# EAGLE design aiotdaan_r2 (EAGLE 7.7.0)
CNAME: AIoT DaaN; CREVISION: R1; DESIGNER: lamloei.com/aiot_daan
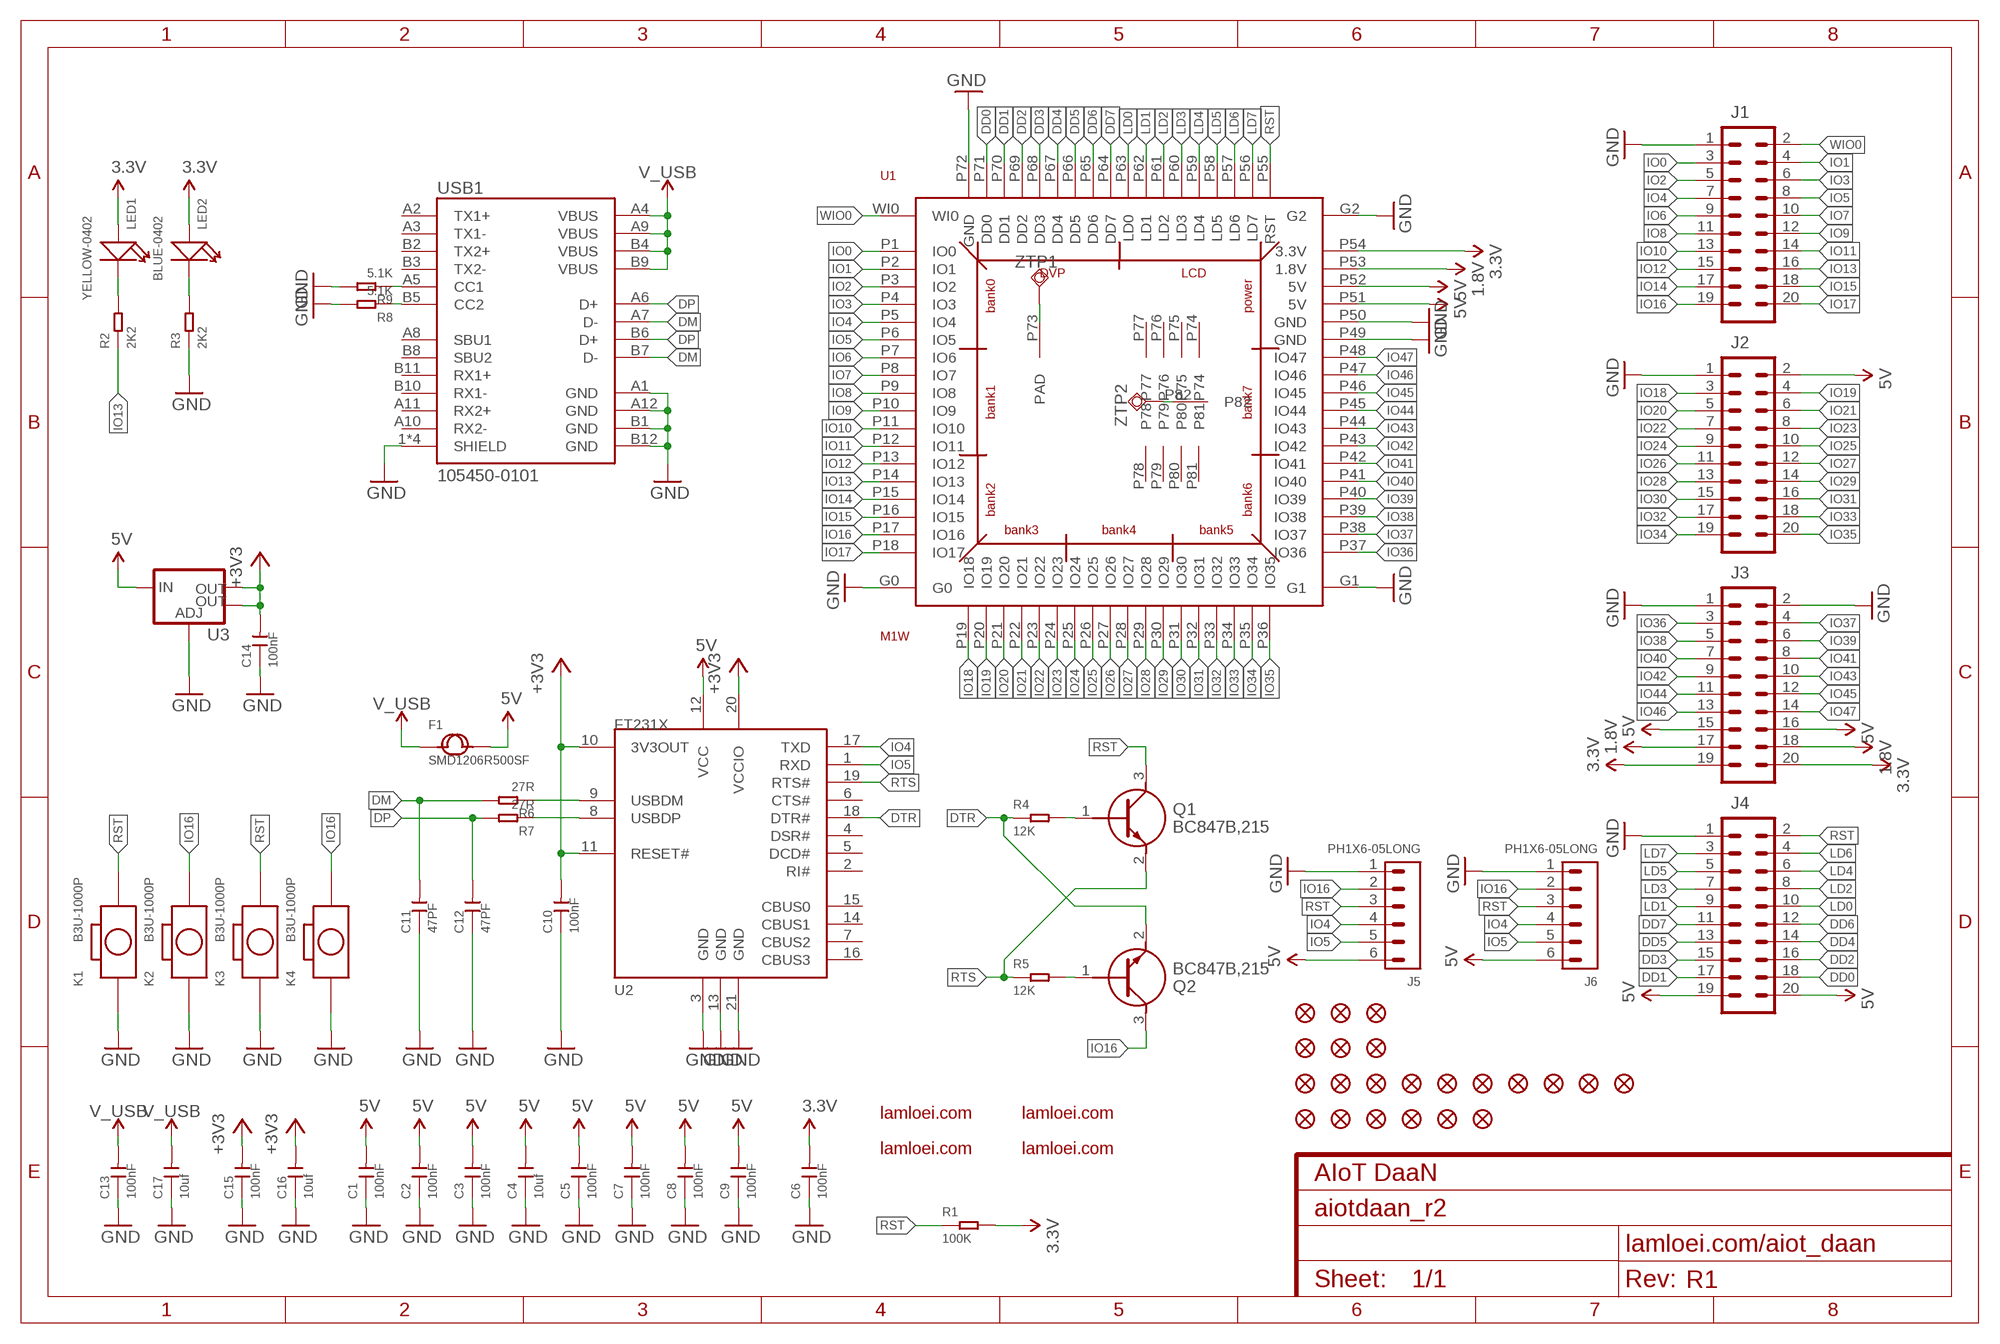
[diagram p0: schematic, sheet 1]

## Parts
C1  100nF  CERAMIC-47PF-50V-5%-NP0(0402)  [C0402]
C2  100nF  CERAMIC-47PF-50V-5%-NP0(0402)  [C0402]
C3  100nF  CERAMIC-47PF-50V-5%-NP0(0402)  [C0402]
C4  10uf  CERAMIC-22UF-6.3V-20%-X5R(0805)  [C0805]
C5  100nF  CERAMIC-47PF-50V-5%-NP0(0402)  [C0402]
C6  100nF  CERAMIC-47PF-50V-5%-NP0(0402)  [C0402]
C7  100nF  CERAMIC-47PF-50V-5%-NP0(0402)  [C0402]
C8  100nF  CERAMIC-47PF-50V-5%-NP0(0402)  [C0402]
C9  100nF  CERAMIC-47PF-50V-5%-NP0(0402)  [C0402]
C10  100nF  CERAMIC-47PF-50V-5%-NP0(0402)  [C0402]
C11  47PF  CERAMIC-47PF-50V-5%-NP0(0402)  [C0402]
C12  47PF  CERAMIC-47PF-50V-5%-NP0(0402)  [C0402]
C13  100nF  CERAMIC-47PF-50V-5%-NP0(0402)  [C0402]
C14  100nF  CERAMIC-47PF-50V-5%-NP0(0402)  [C0402]
C15  100nF  CERAMIC-47PF-50V-5%-NP0(0402)  [C0402]
C16  10uf  CERAMIC-22UF-6.3V-20%-X5R(0805)  [C0805]
C17  10uf  CERAMIC-22UF-6.3V-20%-X5R(0805)  [C0805]
F1  SMD1206R500SF  SMD-PPTC-500MA(1206)  [F1206]
J1  M10X2  [2X10]
J2  M10X2  [2X10]
J3  M10X2  [2X10]
J4  M10X2  [2X10]
J5  PH1X6-05LONG  [PHL005-1-6]
J6  PH1X6-05LONG  [PHL005-1-6]
K1  B3U-1000P  SMD-BUTTON-WITHOUT-BOSS-(2P-3X2.5MM)  [SW2-SMD-3.0X2.5X1.2+0.4MM]
K2  B3U-1000P  SMD-BUTTON-WITHOUT-BOSS-(2P-3X2.5MM)  [SW2-SMD-3.0X2.5X1.2+0.4MM]
K3  B3U-1000P  SMD-BUTTON-WITHOUT-BOSS-(2P-3X2.5MM)  [SW2-SMD-3.0X2.5X1.2+0.4MM]
K4  B3U-1000P  SMD-BUTTON-WITHOUT-BOSS-(2P-3X2.5MM)  [SW2-SMD-3.0X2.5X1.2+0.4MM]
LED1  YELLOW-0402  SMD-LED-CLEAR-BLUE(0402)  [LED-0402]
LED2  BLUE-0402  SMD-LED-CLEAR-BLUE(0402)  [LED-0402]
Q1  BC847B,215  [SOT95P230X110-3N]
Q2  BC847B,215  [SOT95P230X110-3N]
R1  100K  SMD-RES-22R-1%-1/16W(0402)  [R0402]
R2  2K2  SMD-RES-22R-1%-1/16W(0402)  [R0402]
R3  2K2  SMD-RES-22R-1%-1/16W(0402)  [R0402]
R4  12K  SMD-RES-22R-1%-1/16W(0402)  [R0402]
R5  12K  SMD-RES-22R-1%-1/16W(0402)  [R0402]
R6  27R  SMD-RES-22R-1%-1/16W(0402)  [R0402]
R7  27R  SMD-RES-22R-1%-1/16W(0402)  [R0402]
R8  5.1K  SMD-RES-22R-1%-1/16W(0402)  [R0402]
R9  5.1K  SMD-RES-22R-1%-1/16W(0402)  [R0402]
U1  M1W  [M1W]
U2  FT231X-Q  [QFN20]
U3  V_REG_LM1117SOT223  [SOT223]
USB1  105450-0101  [MOLEX_105450-0101]
ZFCB1  FIDUCIAL1X2  [FIDUCIAL-1X2]
ZFCB2  FIDUCIAL1X2  [FIDUCIAL-1X2]
ZFCB3  FIDUCIAL1X2  [FIDUCIAL-1X2]
ZFCT1  FIDUCIAL1X2  [FIDUCIAL-1X2]
ZFCT2  FIDUCIAL1X2  [FIDUCIAL-1X2]
ZFCT3  FIDUCIAL1X2  [FIDUCIAL-1X2]
ZFDB1  FIDUCIAL1X2  [FIDUCIAL-1X2]
ZFDB2  FIDUCIAL1X2  [FIDUCIAL-1X2]
ZFDB3  FIDUCIAL1X2  [FIDUCIAL-1X2]
ZFDB4  FIDUCIAL1X2  [FIDUCIAL-1X2]
ZFDB5  FIDUCIAL1X2  [FIDUCIAL-1X2]
ZFDB6  FIDUCIAL1X2  [FIDUCIAL-1X2]
ZFDT1  FIDUCIAL1X2  [FIDUCIAL-1X2]
ZFDT2  FIDUCIAL1X2  [FIDUCIAL-1X2]
ZFDT3  FIDUCIAL1X2  [FIDUCIAL-1X2]
ZFDT4  FIDUCIAL1X2  [FIDUCIAL-1X2]
ZFDT5  FIDUCIAL1X2  [FIDUCIAL-1X2]
ZFDT6  FIDUCIAL1X2  [FIDUCIAL-1X2]
ZFDT7  FIDUCIAL1X2  [FIDUCIAL-1X2]
ZFDT8  FIDUCIAL1X2  [FIDUCIAL-1X2]
ZFDT9  FIDUCIAL1X2  [FIDUCIAL-1X2]
ZFDT10  FIDUCIAL1X2  [FIDUCIAL-1X2]
ZL1  LAMLOEI_BIGLOGO  [LAMLOEI_BIGLOGO]
ZL2  LAMLOEI_BIGLOGO  [LAMLOEI_BIGLOGO]
ZL3  LAMLEOI_LOGO_3  [LAMLEOI_LOGO_3]
ZL4  LAMLEOI_LOGO_3  [LAMLEOI_LOGO_3]
ZTP1  TPSQTP20SQ  [TP20SQ]
ZTP2  TPSQTP20SQ  [TP20SQ]

## Nets
1.8V: J3.17 J3.18 U1.P53(1.8V)
3.3V: C6.2 J3.19 J3.20 LED1.+ LED2.+ R1.2 U1.P54(3.3V)
5V: C1.2 C2.2 C3.2 C4.2 C5.2 C7.2 C8.2 C9.2 F1.2 J2.2 J3.15 J3.16 J4.19 J4.20 J5.6 J6.6 U1.P51(5V) U1.P52(5V) U2.12(VCC) U3.3(IN)
+3V3: C10.2 C14.2 C15.2 C16.2 U2.10(3V3OUT) U2.11(RESET#) U2.20(VCCIO) U3.2(OUT) U3.4(OUT)
DD0: J4.18 U1.P71(DD0)
DD1: J4.17 U1.P70(DD1)
DD2: J4.16 U1.P69(DD2)
DD3: J4.15 U1.P68(DD3)
DD4: J4.14 U1.P67(DD4)
DD5: J4.13 U1.P66(DD5)
DD6: J4.12 U1.P65(DD6)
DD7: J4.11 U1.P64(DD7)
DM: C11.2 R6.2 USB1.A7(D-) USB1.B7(D-)
DP: C12.2 R7.2 USB1.A6(D+) USB1.B6(D+)
DTR: Q2.2(E) R4.1 U2.18(DTR#)
GND: C1.1 C2.1 C3.1 C4.1 C5.1 C6.1 C7.1 C8.1 C9.1 C10.1 C11.1 C12.1 C13.1 C14.1 C15.1 C16.1 C17.1 J1.1 J2.1 J3.1 J3.2 J4.1 J5.1 J6.1 K1.1 K2.1 K3.1 K4.1 R3.1 R8.2 R9.2 U1.G0 U1.G1 U1.G2 U1.P49(GND) U1.P50(GND) U1.P72(GND) U2.3(GND) U2.13(GND) U2.21(GND) U3.1(ADJ) USB1.1(SHIELD) USB1.2(SHIELD) USB1.3(SHIELD) USB1.4(SHIELD) USB1.A1(GND) USB1.A12(GND) USB1.B1(GND) USB1.B12(GND)
IO0: J1.3 U1.P1(IO0)
IO1: J1.4 U1.P2(IO1)
IO2: J1.5 U1.P3(IO2)
IO3: J1.6 U1.P4(IO3)
IO4: J1.7 J5.4 J6.4 U1.P5(IO4) U2.17(TXD)
IO5: J1.8 J5.5 J6.5 U1.P6(IO5) U2.1(RXD)
IO6: J1.9 U1.P7(IO6)
IO7: J1.10 U1.P8(IO7)
IO8: J1.11 U1.P9(IO8)
IO9: J1.12 U1.P10(IO9)
IO10: J1.13 U1.P11(IO10)
IO11: J1.14 U1.P12(IO11)
IO12: J1.15 U1.P13(IO12)
IO13: J1.16 R2.1 U1.P14(IO13)
IO14: J1.17 U1.P15(IO14)
IO15: J1.18 U1.P16(IO15)
IO16: J1.19 J5.2 J6.2 K2.2 K4.2 Q2.3(C) U1.P17(IO16)
IO17: J1.20 U1.P18(IO17)
IO18: J2.3 U1.P19(IO18)
IO19: J2.4 U1.P20(IO19)
IO20: J2.5 U1.P21(IO20)
IO21: J2.6 U1.P22(IO21)
IO22: J2.7 U1.P23(IO22)
IO23: J2.8 U1.P24(IO23)
IO24: J2.9 U1.P25(IO24)
IO25: J2.10 U1.P26(IO25)
IO26: J2.11 U1.P27(IO26)
IO27: J2.12 U1.P28(IO27)
IO28: J2.13 U1.P29(IO28)
IO29: J2.14 U1.P30(IO29)
IO30: J2.15 U1.P31(IO30)
IO31: J2.16 U1.P32(IO31)
IO32: J2.17 U1.P33(IO32)
IO33: J2.18 U1.P34(IO33)
IO34: J2.19 U1.P35(IO34)
IO35: J2.20 U1.P36(IO35)
IO36: J3.3 U1.P37(IO36)
IO37: J3.4 U1.P38(IO37)
IO38: J3.5 U1.P39(IO38)
IO39: J3.6 U1.P40(IO39)
IO40: J3.7 U1.P41(IO40)
IO41: J3.8 U1.P42(IO41)
IO42: J3.9 U1.P43(IO42)
IO43: J3.10 U1.P44(IO43)
IO44: J3.11 U1.P45(IO44)
IO45: J3.12 U1.P46(IO45)
IO46: J3.13 U1.P47(IO46)
IO47: J3.14 U1.P48(IO47)
LD0: J4.10 U1.P63(LD0)
LD1: J4.9 U1.P62(LD1)
LD2: J4.8 U1.P61(LD2)
LD3: J4.7 U1.P60(LD3)
LD4: J4.6 U1.P59(LD4)
LD5: J4.5 U1.P58(LD5)
LD6: J4.4 U1.P57(LD6)
LD7: J4.3 U1.P56(LD7)
N$1: U1.P73(PAD) ZTP1.TP
N$2: U1.P82 ZTP2.TP
N$3: LED1.- R2.2
N$4: R8.1 USB1.B5(CC2)
N$5: R9.1 USB1.A5(CC1)
N$6: LED2.- R3.2
N$7: R7.1 U2.8(USBDP)
N$8: R6.1 U2.9(USBDM)
N$11: Q2.1(B) R5.2
N$12: Q1.1(B) R4.2
RST: J4.2 J5.3 J6.3 K1.2 K3.2 Q1.3(C) R1.1 U1.P55(RST)
RTS: Q1.2(E) R5.1 U2.19(RTS#)
V_USB: C13.2 C17.2 F1.1 USB1.A4(VBUS) USB1.A9(VBUS) USB1.B4(VBUS) USB1.B9(VBUS)
WIO0: J1.2 U1.WI0
Unconnected: U1.P74 U1.P75 U1.P76 U1.P77 U1.P78 U1.P79 U1.P80 U1.P81 U2.2(RI#) U2.4(DSR#) U2.5(DCD#) U2.6(CTS#) U2.7(CBUS2) U2.14(CBUS1) U2.15(CBUS0) U2.16(CBUS3) USB1.A2(TX1+) USB1.A3(TX1-) USB1.A8(SBU1) USB1.A10(RX2-) USB1.A11(RX2+) USB1.B2(TX2+) USB1.B3(TX2-) USB1.B8(SBU2) USB1.B10(RX1-) USB1.B11(RX1+)

## Library data of the parts
C1-C3 C5-C10 C13-C15 = Capacitor-2016:CERAMIC-47PF-50V-5%-NP0(0402): 302010007; MPN: CC0402JRNPO9BN470; VALUE: 47PF
C4 C16 C17 = Capacitor-2016:CERAMIC-22UF-6.3V-20%-X5R(0805): 302010171; MPN: CC0805MKX5R5BB226; VALUE: 22uf
C11 C12 = Capacitor-2016:CERAMIC-47PF-50V-5%-NP0(0402): 302010007; MPN: CC0402JRNPO9BN470
F1 = Seeed-Fuse-2016:SMD-PPTC-500MA(1206): 307010002; MPN: SMD1206R500SF
J1-J4 = SparkFun-Connectors:M10X2: This was SPECIALLY designed to be used with our Graphic LCD Backpack. Be sure you want to use this! It is not only staggered on each line of header holes, but IT IS ALSO offset of the center point of the top and bottom lines by 5 mil. This causes the headers to lock into place on the "standard" footprint on the LCD screen. The extra squares on the tdocu layer are there simply to reference other pins (if you were to actually populate a longer header than ten long - this is what we do with the backpacks).
J5 J6 = pel_hdr:PH1X6
K1-K4 = Seeed-OPL-Button4:SMD-BUTTON-WITHOUT-BOSS-(2P-3X2.5MM): 311020047
LED1 = Seeed-OPL-Diode:SMD-LED-CLEAR-BLUE(0402): 304090075; MPN: BL-HB337A-AV-TRB; VALUE: BLUE-0402
LED2 = Seeed-OPL-Diode:SMD-LED-CLEAR-BLUE(0402): 304090075; MPN: BL-HB337A-AV-TRB
Q1 Q2 = BC847B_215:BC847B,215: BC847 series - 45 V, 100 mA NPN general-purpose transistors Source: Datasheet <http://uk.rs-online.com/web/p/products/4367947P>; DESCRIPTION: BC847 series - 45 V, 100 mA NPN general-purpose transistors; HEIGHT: 1.1mm; MANUFACTURER_NAME: Nexperia; MANUFACTURER_PART_NUMBER: BC847B,215; RS_PART_NUMBER: 4367947P
R1-R9 = Resistor-2016:SMD-RES-22R-1%-1/16W(0402): 301010052; MPN: RC0402FR-0722RL; VALUE: 22R
U1 = lamloei_m2_m1w:M1W
U2 = FT231X-3:FT231X
U3 = SparkFun-PowerIC-2:V_REG_LM1117: Voltage Regulator LM1117 Standard adjustable voltage regulator but in SMD form. Spark Fun Electronics SKU : COM-00595; PROD_ID: VREG-08170
USB1 = 105450-0101:105450-0101: USB Shielded I/O Receptacle; Type C; Right Angle; Surface Mount; Gold over Nickel; AVAILABILITY: Good; DESCRIPTION: USB Shielded I/O Receptacle; Type C; Right Angle; Surface Mount; Gold over Nickel; MF: Molex; MP: 105450-0101; PACKAGE: None; PRICE: 1.73 USD
ZFCB1-ZFCB3 ZFCT1-ZFCT3 ZFDB1-ZFDB6 ZFDT1-ZFDT10 = SparkFun-Aesthetics:FIDUCIAL: Fiducial Alignment Points Various fiducial points for machine vision alignment.
ZL1 ZL2 = lamloei_logo_3:LAMLOEI_BIGLOGO
ZL3 ZL4 = lamloei_logo_3:LAMLEOI_LOGO_3: lamloei
ZTP1 ZTP2 = testpad:TPSQ: Test pad

## Board
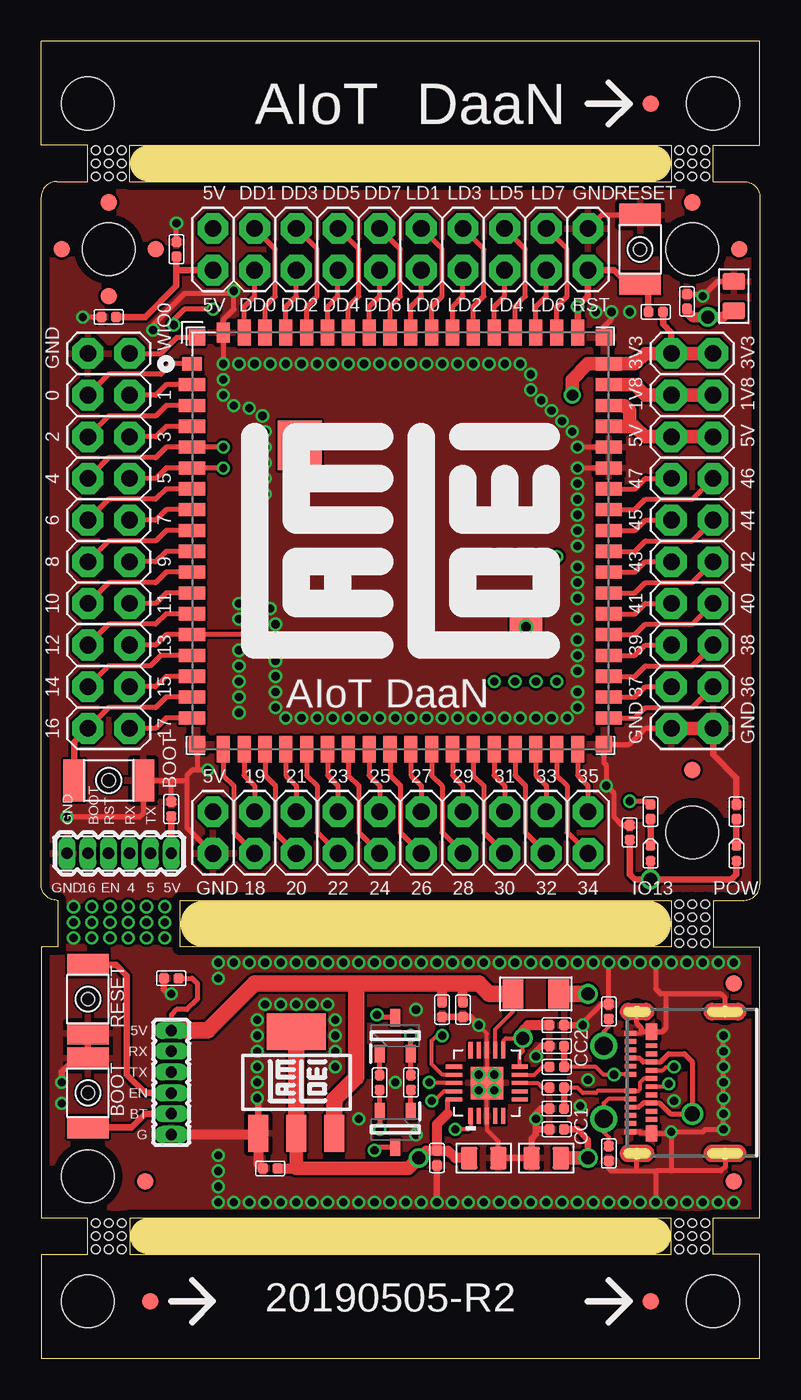
[diagram p1: board, top side]
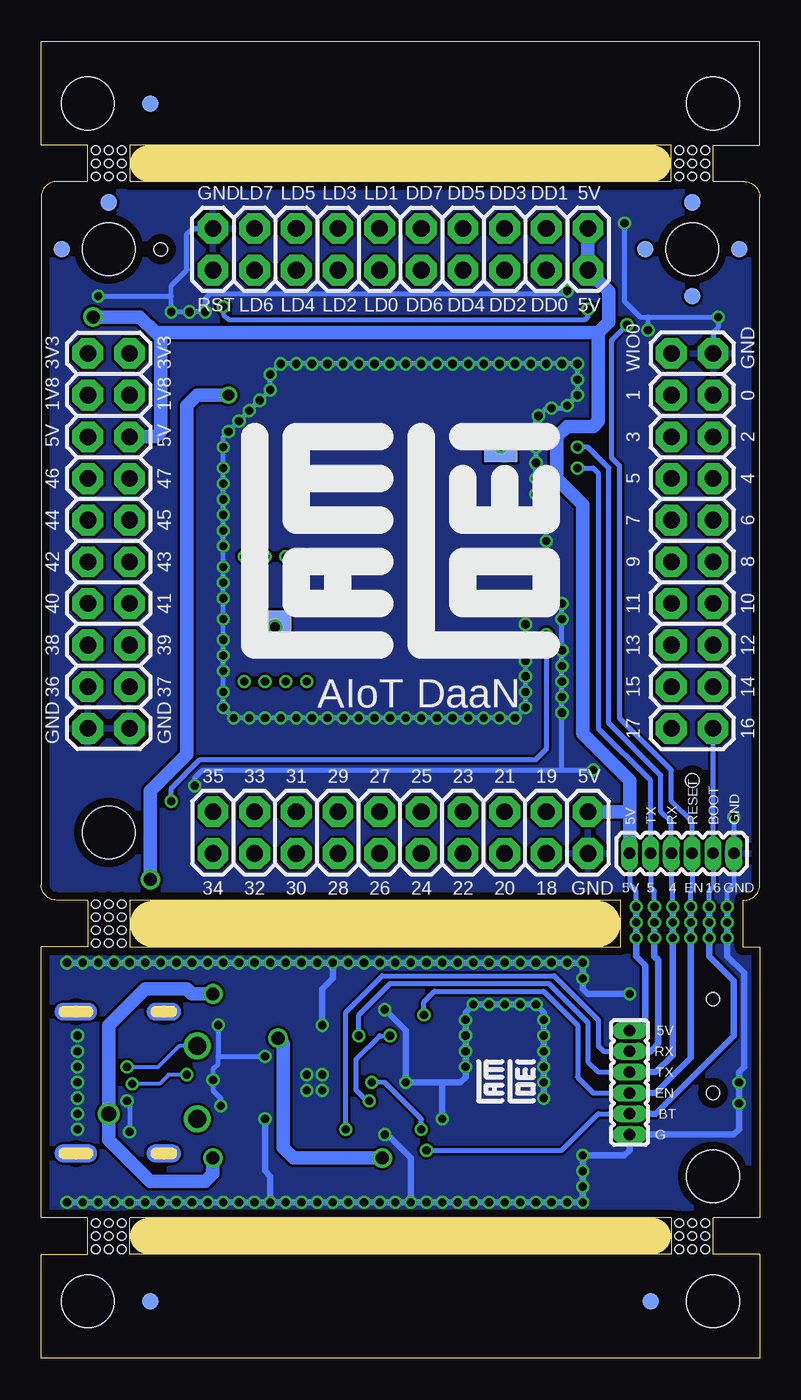
[diagram p2: board, bottom side, seen from below]

Size 43.81 x 80.33 mm. Coordinates in mm from the lower left corner, seen from the top.
Outline: 0.95,71.75 2.86,71.75 2.86,73.98 0,73.98 0,80.33 43.81,80.33 43.81,73.98 40.96,73.98 40.96,71.75 42.86,71.75 arc-90 43.81,70.8 43.81,28.89 arc-90 42.86,27.94 40.96,27.94 40.96,25.08 43.81,25.08 43.81,8.57 40.96,8.57 40.96,6.35 43.81,6.35 43.81,0 0,0 0,6.35 2.86,6.35 2.86,8.57 0,8.57 0,25.08 1.03,25.08 1.03,27.94 0.95,27.94 arc-90 0,28.89 0,70.8 arc-90 0.95,71.75
Outline: 5.4,71.75 38.42,71.75 38.42,73.98 5.4,73.98 5.4,71.75
Outline: 8.49,27.94 38.42,27.94 38.42,25.08 8.49,25.08 8.49,27.94
Outline: 5.4,8.57 38.42,8.57 38.42,6.35 5.4,6.35 5.4,8.57
Copper layers (1*16): Top 0.035mm / dielectric 1.6mm / Bottom 0.035mm
Design rules "Elecrow_2-layer_PCB_eagle_rule-40": minimum track width 6mil, minimum drill 12mil, track to track 6mil, track to pad 6mil, pad to pad 6mil, via to via 8mil, smd to smd 0mil, copper to edge 20mil, drill to drill 10mil, minimum pad ring 6mil, minimum via ring 6mil, stop-mask expansion 0mil, vias tented up to drill 40mil, thermal gap 10mil
Holes 3.2 mm at 4.13,67.63 39.69,67.63 39.69,32.07 2.86,76.52 40.96,76.52 2.86,3.49 40.96,3.49 2.86,11.11
Holes 0.5 mm at 4.13,72.07 39.69,72.07 40.48,72.07 38.89,72.07 39.69,72.87 40.48,72.87 40.48,73.66 39.69,73.66 38.89,72.87 38.89,73.66 3.33,72.07 4.13,72.87 4.92,72.87 4.92,72.07 4.92,73.66 4.13,73.66 3.33,73.66 3.33,72.87 39.69,27.7 40.48,27.7 38.89,27.7 38.89,26.91 39.69,26.91 40.48,26.91 39.69,26.11 38.89,26.11 40.48,26.11 4.13,8.26 4.92,8.26 4.92,7.46 4.13,7.46 3.33,7.46 3.33,8.26 3.33,6.67 4.13,6.67 4.92,6.67 39.69,8.26 40.48,8.26 38.89,8.26 38.89,7.46 39.69,7.46 40.48,7.46 39.69,6.67 38.89,6.67 40.48,6.67 38.89,25.32 39.69,25.32 40.48,25.32
Holes 0.8 mm at 36.51,67.63 4.13,35.24 2.86,21.91 2.86,16.19
Milling: 3 lines

### Footprints (pad centres in the part's own frame; a part is rotated, then mirrored left to right if it is on the bottom)
C0402 = smd 0.635 x 0.635: 1 0,0.445; 2 0,-0.445
C0805 = smd 1.397 x 1.016: 1 0,0.889; 2 0,-0.889
F1206 = smd 1.27 x 1.778: 1 -1.397,0; 2 1.397,0
2X10 = drill 1.016 pad 1.88 octagon: 1 -11.43,-1.27; 2 -11.43,1.27; 3 -8.89,-1.27; 4 -8.89,1.27; 5 -6.35,-1.27; 6 -6.35,1.27; 7 -3.81,-1.27; 8 -3.81,1.27; 9 -1.27,-1.27; 10 -1.27,1.27; 11 1.27,-1.27; 12 1.27,1.27; 13 3.81,-1.27; 14 3.81,1.27; 15 6.35,-1.27; 16 6.35,1.27; 17 8.89,-1.27; 18 8.89,1.27; 19 11.43,-1.27; 20 11.43,1.27
PHL005-1-6 = drill 0.7 pad 1.016 long: 1 0,0; 2 1.27,0; 3 2.54,0; 4 3.81,0; 5 5.08,0; 6 6.35,0
SW2-SMD-3.0X2.5X1.2+0.4MM = smd 1.346 x 2.54: 1 -2.095,0; 2 2.095,0
LED-0402 = smd 0.58 x 0.58: + -0.468,0; - 0.468,0
SOT95P230X110-3N = smd 1.05 x 0.6: 1 -1.1,0.95; 2 -1.1,-0.95; 3 1.1,0
R0402 = smd 0.635 x 0.635: 1 0,0.445; 2 0,-0.445
M1W = smd 1 x 1: G0 25.1,25.1; G1 0.3,25.1; G2 0.3,0.3; WI0 25.1,0.3 | smd 1.2 x 0.8: P1 25.4,1.905 | smd 1.6 x 0.8: P2 25.4,3.175; P3 25.4,4.445; P4 25.4,5.715; P5 25.4,6.985; P6 25.4,8.255; P7 25.4,9.525; P8 25.4,10.795; P9 25.4,12.065; P10 25.4,13.335; P11 25.4,14.605; P12 25.4,15.875; P13 25.4,17.145; P14 25.4,18.415; P15 25.4,19.685; P16 25.4,20.955; P17 25.4,22.225; P18 25.4,23.495; P37 0,23.495; P38 0,22.225; P39 0,20.955; P40 0,19.685; P41 0,18.415; P42 0,17.145; P43 0,15.875; P44 0,14.605; P45 0,13.335; P46 0,12.065; P47 0,10.795; P48 0,9.525; P49 0,8.255; P50 0,6.985; P51 0,5.715; P52 0,4.445; P53 0,3.175; P54 0,1.905 | smd 0.8 x 1.6: P19 23.495,25.4; P20 22.225,25.4; P21 20.955,25.4; P22 19.685,25.4; P23 18.415,25.4; P24 17.145,25.4; P25 15.875,25.4; P26 14.605,25.4; P27 13.335,25.4; P28 12.065,25.4; P29 10.795,25.4; P30 9.525,25.4; P31 8.255,25.4; P32 6.985,25.4; P33 5.715,25.4; P34 4.445,25.4; P35 3.175,25.4; P36 1.905,25.4; P55 1.905,0; P56 3.175,0; P57 4.445,0; P58 5.715,0; P59 6.985,0; P60 8.255,0; P61 9.525,0; P62 10.795,0; P63 12.065,0; P64 13.335,0; P65 14.605,0; P66 15.875,0; P67 17.145,0; P68 18.415,0; P69 19.685,0; P70 20.955,0; P71 22.225,0 | smd 0.8 x 1.2: P72 23.495,0 | smd 2.67 x 3.02: P73 18.835,6.87 | drill 0.5: P74 3.175,13.652; P75 4.445,13.652; P76 5.715,13.652; P77 6.985,13.652; P78 6.985,21.273; P79 5.715,21.273; P80 4.445,21.273; P81 3.175,21.273 | smd 1.98 x 1.98: P82 5.05,17.96
QFN20 = smd 1 x 0.25: 1 -2.032,0.968; 2 -2.032,0.468; 3 -2.032,-0.032; 4 -2.032,-0.532; 5 -2.032,-1.032; 11 1.968,-1.032; 12 1.968,-0.532; 13 1.968,-0.032; 14 1.968,0.468; 15 1.968,0.968 | smd 0.25 x 1: 6 -1.032,-2.032; 7 -0.532,-2.032; 8 -0.032,-2.032; 9 0.468,-2.032; 10 0.968,-2.032; 16 0.968,1.968; 17 0.468,1.968; 18 -0.032,1.968; 19 -0.532,1.968; 20 -1.032,1.968 | smd 2 x 2: 21 -0.032,-0.032
SOT223 = smd 1.219 x 2.235: 1 -2.311,-3.099; 2 0,-3.099; 3 2.311,-3.099 | smd 3.6 x 2.2: 4 0,3.099
MOLEX_105450-0101 = smd 0.1 x 0.2: 1 -4.7,3.4; 2 3.9,3.4; 3 -4.7,-2; 4 4.7,-2 | smd 0.3 x 0.7: A1 -3,3.77; A2 -2.5,3.77; A3 -2,3.77; A4 -1.5,3.77; A5 -1,3.77; A6 -0.5,3.77; A7 0.5,3.77; A8 1,3.77; A9 1.5,3.77; A10 2,3.77; A11 2.5,3.77; A12 3,3.77; B2 2.25,2.47; B3 1.75,2.47; B4 1.25,2.47; B5 0.75,2.47; B6 0.25,2.47; B7 -0.25,2.47; B8 -0.75,2.47; B9 -1.25,2.47; B10 -1.75,2.47; B11 -2.25,2.47 | smd 1 x 0.7: B1 3.1,2.47; B12 -3.1,2.47 | hole 0.6: -4.32,3.36; 4.32,3.36; -4.32,-2; 4.32,-2
FIDUCIAL-1X2 = smd 1 x 1: 1 0,0
TP20SQ = smd 2 x 2: TP 0,0

### Placement (x,y rotation side)
C1  8.26,67.63 0 top
C2  4.13,63.5 90 top
C3  39.37,64.45 0 top
C4  42.23,64.77 0 top
C5  7.94,33.5 0 top
C6  35.88,32.07 0 top
C7  7.94,23.18 90 top
C8  24.45,21.27 180 top
C9  25.72,21.27 180 top
C10  31.43,20.32 270 top
C11  31.43,19.05 90 top
C12  31.43,15.24 90 top
C13  31.43,13.97 90 top
C14  13.97,11.59 90 top
C15  24.13,12.22 180 top
C16  26.99,12.22 270 top
C17  30.8,12.22 90 top
F1  30.16,22.23 180 top
J1  4.13,49.85 270 top
J2  21.91,32.07 0 top
J3  39.69,49.85 90 top
J4  21.91,67.63 180 top
J5  1.59,30.8 0 top
J6  7.94,13.65 90 top
K1  36.51,67.63 270 top
K2  4.13,35.24 180 top
K3  2.86,21.91 90 top
K4  2.86,16.19 270 top
LED1  37.15,30.8 90 top
LED2  42.39,30.8 90 top
Q1  21.59,19.69 90 top
Q2  21.59,13.97 270 top
R1  37.47,63.82 90 top
R2  37.15,33.34 0 top
R3  42.39,33.34 0 top
R4  20.64,16.83 180 top
R5  22.54,16.83 0 top
R6  31.43,17.78 90 top
R7  31.43,16.51 90 top
R8  34.61,21.15 180 top
R9  34.61,12.5 0 top
U1  34.61,62.55 180 top
U2  27.15,16.83 90 top
U3  15.56,16.83 0 top
USB1  39.69,16.83 90 top
ZFCB1  37.15,76.52 0 bottom
ZFCB2  6.67,3.49 0 bottom
ZFCB3  37.15,3.49 0 bottom
ZFCT1  37.15,76.52 0 top
ZFCT2  6.67,3.49 0 top
ZFCT3  37.15,3.49 0 top
ZFDB1  4.13,70.48 0 bottom
ZFDB2  39.69,70.48 0 bottom
ZFDB3  1.27,67.63 0 bottom
ZFDB4  6.99,67.63 0 bottom
ZFDB5  42.55,67.63 0 bottom
ZFDB6  4.13,64.77 0 bottom
ZFDT1  4.13,70.48 0 top
ZFDT2  39.69,70.48 0 top
ZFDT3  1.27,67.63 0 top
ZFDT4  6.99,67.63 0 top
ZFDT5  42.55,67.63 0 top
ZFDT6  4.13,64.77 0 top
ZFDT7  39.69,35.88 0 top
ZFDT8  42.23,22.86 0 top
ZFDT9  6.35,10.8 0 top
ZFDT10  42.23,10.8 0 top
ZL1  13.02,43.5 0 top
ZL2  30.8,43.5 0 bottom
ZL3  13.65,15.4 0 top
ZL4  17.46,15.4 0 bottom
ZTP1  15.8,55.64 0 bottom
ZTP2  29.56,44.59 0 bottom

### Tracks (layer width: path | path; a pad name or v marks a point on that pad's centre or on a via)
1.8V
  Top 0.813: U1.P53 36.2,59.37 36.83,58.74 J3.18 J3.17
3.3V  (via drill 0.7, 0.8)
  Top 0.406: R1.2 37.91,63.06 38.42,62.55 J3.20 | LED1.+ v37.15,29.21 | C6.2 35.88,29.53 36.2,29.21 v37.15,29.21 | LED2.+ 42.39,29.53 42.07,29.21 v37.15,29.21
  Top 0.813: J3.19 J3.20 36.83,61.28 36.2,60.64 U1.P54 33.34,60.64 32.38,59.69 v32.38,58.74
  Bottom 0.813: v37.15,29.21 37.15,34.61 34.92,36.83 34.92,58.1 34.29,58.74 v32.38,58.74
5V  (via drill 0.5, 0.8)
  Top 0.254: U2.12 27.68,20.06 28.77,21.15 F1.2
  Top 0.305: C7.2 9.21,23.18 9.53,22.86 9.53,21.91 8.89,21.27 8.26,21.27 7.94,20.96 J6.6
  Top 0.406: C1.2 8.26,66.36 | 8.26,66.36 J4.20 | C2.2 6.35,63.5 8.26,65.41 8.26,66.36 | J5.6 C5.2
  Top 0.61: C3.2 39.37,63.82 39.69,63.5 v40.64,63.5 41.59,63.5 41.97,63.88 C4.2 | C8.2 24.45,22.86 | C9.2 25.72,22.54 25.4,22.86
  Top 0.813: U1.P51 35.88,56.83 | 35.88,56.83 36.2,56.83 36.83,56.2 J3.16 J3.15 | U1.P52 35.56,58.1 35.88,57.78 35.88,56.83
  Top 1.016: U3.3 17.87,15.81 19.21,17.15 19.21,22.86 | 19.21,22.86 13.02,22.86 10.16,20 J6.6 | F1.2 27.3,22.23 26.67,22.86 25.4,22.86 24.45,22.86 19.21,22.86
  Bottom 0.305: J5.6 7.94,28.89 7.54,28.5 v7.54,27.54
  Bottom 0.406: v7.54,27.54 v7.54,26.59 v7.54,25.64 7.54,24.53 6.99,23.97 6.99,20.32 7.3,20 J6.6
  Bottom 0.813: 36.83,62.55 36.51,62.23 36.51,56.52 36.83,56.2 J3.16 | v40.64,63.5 37.78,63.5 36.83,62.55 | 9.84,62.55 36.83,62.55 | J4.19 J4.20 9.21,65.09 9.21,63.18 9.84,62.55 | 9.84,62.55 9.84,57.15 10.16,56.83 11.75,56.83 12.38,56.2 12.38,53.66 10.79,52.07 10.79,38.1 7.94,35.24 7.94,33.34 | 7.94,33.34 J5.6 | J2.2 7.94,33.34
+3V3  (via drill 0.8)
  Top 0.254: U2.11 28.18,19.37 28.34,19.53 v29.37,19.53 29.37,18.73 29.18,18.54 U2.10 | U2.20 24.84,15.8 24.77,15.72
  Top 0.305: 24.77,15.72 24.77,14.92
  Top 0.61: C10.2 29.69,20.32 29.37,20 v29.37,19.53 | C16.2 25.24,12.22 24.8,12.67 C15.2 | C15.2 23.46,12.67 v23.02,12.22 | 24.77,14.92 24.13,14.29 C15.2 | C14.2 15.56,11.59
  Top 0.813: U3.2 15.56,11.59 22.38,11.59 v23.02,12.22
  Top 1.016: U3.2 U3.4
  Bottom 0.813: v29.37,19.53 29.05,19.21 29.05,12.86 28.42,12.22 v23.02,12.22
DD0
  Top 0.305: U1.P71 12.38,64.14 13.02,64.77 J4.18
DD1
  Top 0.305: U1.P70 13.65,64.14 14.29,64.77 14.29,67.63 J4.17
DD2
  Top 0.305: U1.P69 14.92,64.14 15.56,64.77 J4.16
DD3
  Top 0.305: U1.P68 16.19,64.14 16.83,64.77 16.83,67.63 J4.15
DD4
  Top 0.305: U1.P67 17.46,64.14 18.1,64.77 J4.14
DD5
  Top 0.305: U1.P66 18.73,64.14 19.37,64.77 19.37,67.63 J4.13
DD6
  Top 0.305: U1.P65 20,64.14 20.64,64.77 J4.12
DD7
  Top 0.305: U1.P64 21.27,64.14 21.91,64.77 21.91,67.63 J4.11
DM  (via drill 0.5)
  Top 0.254: R6.2 33.81,17.78 34.29,17.3 v34.92,17.3 34.95,17.33 USB1.A7 | USB1.B7 38.09,16.58 v38.26,16.75
  Top 0.406: R6.2 C11.2
  Bottom 0.254: v34.92,17.3 36.04,17.3 36.59,16.75 v38.26,16.75
DP
  Top 0.254: R7.2 32.7,16.51 33.02,16.19 33.81,16.19 33.95,16.33 USB1.A6 36.41,16.33 36.51,16.43 36.51,16.83 36.76,17.08 USB1.B6
  Top 0.406: C12.2 R7.2
DTR  (via drill 0.5)
  Top 0.254: Q2.2 | U2.18 23.69,16.8 v23.65,16.83
  Top 0.305: Q2.2 v20.64,13.97 | Q2.2 R4.1
  Bottom 0.305: v20.64,13.97 20.64,14.61 22.86,16.83 v23.65,16.83
GND  (via drill 0.5)
  Top 0.254: v26.67,20.32 27.18,19.81 U2.13 U2.21 U2.3 27.18,13.94 27.88,13.24 C16.1 | USB1.A12 36.5,19.83 36.6,19.93
  Top 0.305: C4.1 41.21,65.66 v40.32,64.77 40.2,64.9 C3.1 | K1.1 34.16,69.72 J4.1 | U1.G2 34.31,62.88 34.77,63.34 v34.77,63.82 | U1.P50 v32.7,55.56 | U1.P49 v32.7,54.29 | v11.11,60.64 U1.P72 11.11,63.34 11.75,63.98 v11.75,65.09 11.59,65.09 11.43,64.93 8.73,64.93 6.83,63.02 v6.83,62.71 | C2.1 v2.54,63.5 | J3.2 36.83,38.42 35.86,37.45 U1.G1 34.31,36.34 34.45,36.2 v34.45,34.93 34.92,34.45 34.92,33.02 35.43,32.51 C6.1 | 7.94,35.24 K2.1 6.22,33.21 6.03,33.02 v1.59,33.02 | v10.16,35.88 9.53,35.88 | U1.G0 9.51,35.9 9.53,35.88 | C1.1 v8.26,69.22 | C5.1 7.94,35.24 | v26.67,16.35 v27.62,16.35 | v27.62,16.35 v27.62,17.3 v26.67,17.3 | v27.62,16.35 U2.21 | J2.1 8.89,32.39 8.89,35.24 | 9.53,35.88 9.21,35.88 8.89,35.56 8.89,35.24 | 7.94,35.24 8.89,35.24 | USB1.4 41.69,21.97 41.43,22.23 38.1,22.23 | 38.1,22.23 37.78,22.23 37.47,22.54 v37.47,24.13 | 38.1,22.23 38.1,20.16 37.87,19.93 USB1.B1 36.6,19.93 | 36.6,19.93 36.51,19.84 | 36.6,19.93 36.6,20.16 36.29,20.47 USB1.2 | USB1.3 41.69,11.68 41.43,11.43 38.42,11.43 | 37.47,11.43 v37.47,9.53 | 38.42,11.43 37.47,11.43 | v34.61,24.13 R8.2 34.14,21.6 33.02,20.48 v33.02,20.32 | USB1.A1 36.5,13.83 36.6,13.73 USB1.B12 38.33,13.73 v38.42,13.81 | R9.2 34.61,11.59 34.77,11.43 36.27,11.43 | 36.27,11.43 37.47,11.43 | USB1.1 36.29,11.44 36.27,11.43 | v41.59,19.69 v41.59,18.73 v41.59,17.78 v41.59,16.83 v41.59,15.88 v41.59,14.92 v41.59,13.97 40.48,13.97 40.32,13.81 v38.42,13.81 | v38.42,13.81 38.42,11.43
  Top 0.406: R3.1 42.39,35.4 40.96,36.83 J3.1 | K3.1 K4.1 2.1,18.29 1.27,17.46 v1.27,16.83 | C7.1 7.49,22.51 7.78,22.23 v7.94,22.23 | U3.1 13.25,15.81 v13.18,15.88 | C11.1 30.48,19.05 30.16,18.73 v30.16,18.41 | C10.1 v33.02,20.32 | C12.1 30.48,15.24 30.16,14.92 v30.16,14.61 30.16,13.97 | 30.16,13.97 30.16,13.65 29.91,13.4 C17.1 C16.1 | C13.1 30.16,13.97 | C15.1 v24.13,9.53 | C8.1 C9.1 26.16,20.83 v26.67,20.32
  Top 0.61: C14.1 13.25,11.87 U3.1 13.17,13.65 J6.1
  Top 0.813: J3.1 J3.2
  Bottom 0.305: v34.45,34.93 34.45,35.4 33.97,35.88 12.06,35.88 | v40.32,64.77 35.88,64.77 | 12.06,35.88 v10.16,35.88 | J1.1 2.86,62.55 2.54,62.86 v2.54,63.5 6.83,63.5 | 12.06,35.88 v12.06,39.37 v12.06,40.32 v12.06,41.28 v12.06,42.23 v12.06,43.18 v12.06,45.09 v12.06,46.04 v13.02,46.04 | v14.29,44.77 14.29,45.4 v13.97,45.72 13.65,46.04 v13.02,46.04 | v13.02,46.04 v13.02,46.99 v13.02,47.94 v13.02,48.89 v13.02,49.85 v13.02,50.8 v13.02,51.75 13.02,52.07 v13.65,52.7 v13.65,53.66 v13.65,54.61 v13.65,55.56 v13.65,56.52 13.65,57.31 v13.49,57.47 13.02,57.94 v12.7,57.94 11.91,57.94 v11.75,58.1 v11.11,58.74 v11.11,59.69 v11.11,60.64 v12.06,60.64 v13.02,60.64 v13.97,60.64 v14.92,60.64 v15.88,60.64 v16.83,60.64 v17.78,60.64 v18.73,60.64 v19.68,60.64 v20.64,60.64 v21.59,60.64 v22.54,60.64 v23.5,60.64 v24.45,60.64 v25.4,60.64 v26.35,60.64 v27.3,60.64 v28.26,60.64 v29.21,60.64 v29.84,60.01 v29.84,59.05 v30.48,58.42 v31.11,57.78 v31.75,57.15 v32.38,56.52 32.7,56.2 v32.7,55.56 v32.7,54.29 v32.7,53.34 v32.7,52.39 v32.7,51.44 v32.7,50.48 v32.7,49.53 v32.7,48.26 v32.7,47.31 v32.7,46.36 v32.7,45.09 v32.7,43.81 v32.7,42.86 v32.7,41.91 v32.7,40.64 v32.7,39.69 v32.07,39.05 v31.11,39.05 v30.16,39.05 v29.21,39.05 v28.26,39.05 v27.3,39.05 v26.35,39.05 v25.4,39.05 v24.45,39.05 v23.5,39.05 v22.54,39.05 v21.59,39.05 v20.64,39.05 v19.68,39.05 v18.73,39.05 v17.78,39.05 v16.83,39.05 v15.88,39.05 v14.92,39.05 v14.29,39.69 v14.29,40.64 v14.29,41.59 v14.29,42.55 v14.29,43.5 | v11.75,65.09 11.91,64.93 33.5,64.93 33.81,64.61 v33.81,63.82 v34.77,63.82 v35.88,63.82 35.88,64.77
  Bottom 0.305: 6.83,63.5 v6.83,62.71 | v8.26,69.22 8.26,64.45 7.3,63.5 6.83,63.5 | v1.98,27.54 1.98,28.5 1.59,28.89 J5.1 v1.59,33.02 | 35.88,64.77 35.88,65.41 34.92,66.36 34.92,68.58 34.61,68.9 J4.1 | v32.86,15.4 32.86,15.88 33.34,16.35 v33.34,16.99 33.34,17.62 33.02,17.94 33.02,18.41 | v33.02,20.32 33.02,18.41 | 33.02,18.41 v30.16,18.41 | v38.58,15.72 38.42,15.56 v38.42,13.81
  Bottom 0.406: v1.98,27.54 v1.98,26.59 v1.98,25.64 1.98,24.53 0.95,23.5 0.95,17.78 1.27,17.46 v1.27,16.83 v1.27,15.56 1.27,13.97 1.59,13.65 J6.1 7.94,12.7 8.26,12.38 v10.79,12.38 v10.79,11.43 v10.79,10.48 v10.79,9.53 v11.75,9.53 v12.7,9.53 v13.65,9.53 v14.61,9.53 v15.56,9.53 v16.51,9.53 v17.46,9.53 v18.41,9.53 v19.37,9.53 v20.32,9.53 v21.27,9.53 | v29.84,9.53 v30.8,9.53 v31.75,9.53 v32.7,9.53 v33.66,9.53 v34.61,9.53 v35.56,9.53 v36.51,9.53 v37.47,9.53 v38.42,9.53 v39.37,9.53 v40.32,9.53 v41.27,9.53 v42.23,9.53 | v29.84,9.53 v28.89,9.53 v27.94,9.53 v26.99,9.53 v26.04,9.53 v25.08,9.53 v24.13,9.53 v23.18,9.53 v22.23,9.53 v21.27,9.53 | v13.18,15.88 v13.18,16.83 v13.18,17.78 v13.18,18.73 v13.18,19.69 v13.18,20.64 13.18,21.11 v13.65,21.59 v14.61,21.59 v15.56,21.59 v16.51,21.59 v17.46,21.59 17.94,21.11 v17.94,20.64 v17.94,19.69 v17.94,18.73 v17.94,17.78 17.94,17.15 18.26,16.83 19.37,16.83 | v7.94,22.23 10.48,22.23 10.79,22.54 v10.79,23.18 v10.79,24.13 v11.75,24.13 v12.7,24.13 v13.65,24.13 v14.61,24.13 v15.56,24.13 v16.51,24.13 v17.46,24.13 v18.41,24.13 v19.37,24.13 v20.32,24.13 v21.27,24.13 v22.23,24.13 v23.18,24.13 v24.13,24.13 v25.08,24.13 v26.04,24.13 | v30.16,14.61 30.16,11.43 29.84,11.11 v29.84,9.53 | v26.67,20.32 26.67,22.54 26.04,23.18 v26.04,24.13 | v26.04,24.13 v26.99,24.13 v27.94,24.13 v28.89,24.13 v29.84,24.13 v30.8,24.13 v31.75,24.13 v32.7,24.13 v33.66,24.13 v34.61,24.13 v35.56,24.13 v36.51,24.13 v37.47,24.13 v38.42,24.13 v39.37,24.13 v40.32,24.13 v41.27,24.13 v42.23,24.13 | v19.37,14.61 19.37,16.83 | v22.86,13.65 22.7,13.65 21.27,12.22 v21.27,9.53
  Bottom 0.406: v22.86,21.27 21.59,20 v21.59,16.83 19.37,16.83
  pour Bottom: 0,27.94 43.81,27.94 43.81,71.75 0,71.75
  pour Top: 0,71.75 43.81,71.75 43.81,27.94 0,27.94
  pour Top: 0,25.08 43.81,25.08 43.81,8.57 0,8.57
  pour Bottom: 0,25.08 43.81,25.08 43.81,8.57 0,8.57
IO0
  Top 0.305: U1.P1 7.94,60.64 7.3,60.01 4.13,60.01 J1.3
IO1
  Top 0.305: U1.P2 7.62,59.37 6.99,58.74 J1.4
IO2
  Top 0.305: U1.P3 7.62,58.1 6.99,57.47 4.13,57.47 J1.5
IO3
  Top 0.305: U1.P4 7.62,56.83 6.99,56.2 J1.6
IO4  (via drill 0.5)
  Top 0.254: U2.17 24.46,17.3 23.81,17.94 23.81,19.37 24.13,19.69 v24.45,19.69
  Top 0.305: J1.7 4.13,54.93 6.99,54.93 7.62,55.56 U1.P5 v11.11,55.56
  Bottom 0.305: v11.11,55.56 10.48,55.56 9.21,54.29 9.21,38.73 6.03,35.56 6.03,33.34 5.4,32.7 J5.4 5.4,28.58 5.32,28.5 v5.32,27.54 | v24.45,19.69 24.45,20.96 22.54,22.86 12.86,22.86 10.48,20.48 10.48,18.1 9.84,17.46 J6.4
  Bottom 0.406: v5.32,27.54 v5.32,26.59 v5.32,25.64 5.32,18.49 6.35,17.46 J6.4
IO5  (via drill 0.5)
  Top 0.254: U2.1 26.18,14.11 26.04,13.97 v25.24,13.97
  Top 0.305: J1.8 6.99,53.66 7.62,54.29 U1.P6 v11.11,54.29
  Bottom 0.305: v11.11,54.29 10.16,54.29 9.84,53.98 9.84,38.42 6.67,35.24 J5.5 6.67,28.73 6.43,28.5 v6.43,27.54 | v25.24,13.97 25.24,21.11 23.02,23.34 12.54,23.34 9.84,20.64 9.84,19.05 9.53,18.73 J6.5
  Bottom 0.406: v6.43,27.54 v6.43,26.59 v6.43,25.64 6.43,24.53 6.19,24.29 6.19,19.21 6.67,18.73 J6.5
IO6
  Top 0.305: U1.P7 7.62,53.02 6.99,52.39 4.13,52.39 J1.9
IO7
  Top 0.305: U1.P8 7.62,51.75 6.99,51.12 J1.10
IO8
  Top 0.305: U1.P9 7.62,50.48 6.99,49.85 4.13,49.85 J1.11
IO9
  Top 0.305: U1.P10 7.62,49.21 6.99,48.58 J1.12
IO10
  Top 0.305: U1.P11 7.62,47.94 6.99,47.31 4.13,47.31 J1.13
IO11
  Top 0.305: U1.P12 7.62,46.67 6.99,46.04 J1.14
IO12
  Top 0.305: U1.P13 7.62,45.4 6.99,44.77 4.13,44.77 J1.15
IO13  (via drill 0.5)
  Top 0.305: J1.16 6.99,43.5 7.62,44.13 U1.P14 v13.02,44.13 | R2.1 37.02,33.78 36.83,33.97 v35.88,33.97
  Bottom 0.305: v35.88,33.97 35.88,34.77 34.13,36.51 13.65,36.51 13.02,37.15 v13.02,44.13
IO14
  Top 0.305: U1.P15 7.3,42.86 6.67,42.23 4.13,42.23 J1.17
IO15
  Top 0.305: U1.P16 7.62,41.59 6.99,40.96 J1.18
IO16  (via drill 0.5)
  Top 0.305: U1.P17 7.62,40.32 6.99,39.69 4.13,39.69 J1.19 | Q2.3 20.49,12.87 v20.32,12.7
  Top 0.406: K2.2 2.03,37.59 J1.19 | K4.2 5.52,14.1 6.35,14.92 J6.2
  Bottom 0.305: v3.1,27.54 3.1,28.5 2.86,28.73 J5.2 J1.19 | v20.32,12.7 12.06,12.7 9.84,14.92 J6.2
  Bottom 0.406: v3.1,27.54 v3.1,26.59 v3.1,25.64 3.1,24.53 1.59,23.02 1.59,19.69 6.35,14.92 J6.2
IO17
  Top 0.305: U1.P18 7.62,39.05 6.99,38.42 J1.20
IO18
  Top 0.305: U1.P19 11.11,35.56 11.75,34.93 11.75,32.07 J2.3
IO19
  Top 0.305: U1.P20 12.38,35.56 13.02,34.93 J2.4
IO20
  Top 0.305: U1.P21 13.65,35.56 14.29,34.93 14.29,32.07 J2.5
IO21
  Top 0.305: U1.P22 14.92,35.56 15.56,34.93 J2.6
IO22
  Top 0.305: U1.P23 16.19,35.56 16.83,34.93 16.83,32.07 J2.7
IO23
  Top 0.305: U1.P24 17.46,35.56 18.1,34.93 J2.8
IO24
  Top 0.305: U1.P25 18.73,35.56 19.37,34.93 19.37,32.07 J2.9
IO25
  Top 0.305: U1.P26 20,35.56 20.64,34.93 J2.10
IO26
  Top 0.305: U1.P27 21.27,35.56 21.91,34.93 21.91,32.07 J2.11
IO27
  Top 0.305: U1.P28 22.54,35.56 23.18,34.93 J2.12
IO28
  Top 0.305: U1.P29 23.81,35.56 24.45,34.93 24.45,32.07 J2.13
IO29
  Top 0.305: U1.P30 25.08,35.56 25.72,34.93 J2.14
IO30
  Top 0.305: U1.P31 26.35,35.56 26.99,34.93 26.99,32.07 J2.15
IO31
  Top 0.305: U1.P32 27.62,35.56 28.26,34.93 J2.16
IO32
  Top 0.305: U1.P33 28.89,35.56 29.53,34.93 29.53,32.07 J2.17
IO33
  Top 0.305: U1.P34 30.16,35.56 30.8,34.93 J2.18
IO34
  Top 0.305: U1.P35 31.43,35.56 32.07,34.93 32.07,32.07 J2.19
IO35
  Top 0.305: U1.P36 32.7,35.56 33.34,34.93 J2.20
IO36
  Top 0.305: U1.P37 36.2,39.05 36.83,39.69 39.69,39.69 J3.3
IO37
  Top 0.305: U1.P38 36.2,40.32 36.83,40.96 J3.4
IO38
  Top 0.305: U1.P39 36.2,41.59 36.83,42.23 39.69,42.23 J3.5
IO39
  Top 0.305: U1.P40 36.2,42.86 36.83,43.5 J3.6
IO40
  Top 0.305: U1.P41 36.2,44.13 36.83,44.77 39.69,44.77 J3.7
IO41
  Top 0.305: U1.P42 36.2,45.4 36.83,46.04 J3.8
IO42
  Top 0.305: U1.P43 36.2,46.67 36.83,47.31 39.69,47.31 J3.9
IO43
  Top 0.305: U1.P44 36.2,47.94 36.83,48.58 J3.10
IO44
  Top 0.305: U1.P45 36.2,49.21 36.83,49.85 39.69,49.85 J3.11
IO45
  Top 0.305: U1.P46 36.2,50.48 36.83,51.12 J3.12
IO46
  Top 0.305: U1.P47 36.2,51.75 36.83,52.39 39.69,52.39 J3.13
IO47
  Top 0.305: U1.P48 36.2,53.02 36.83,53.66 J3.14
LD0
  Top 0.305: U1.P63 22.54,64.14 23.18,64.77 J4.10
LD1
  Top 0.305: U1.P62 23.81,64.14 24.45,64.77 24.45,67.63 J4.9
LD2
  Top 0.305: U1.P61 25.08,64.14 25.72,64.77 J4.8
LD3
  Top 0.305: U1.P60 26.35,64.14 26.99,64.77 26.99,67.63 J4.7
LD4
  Top 0.305: U1.P59 27.62,64.14 28.26,64.77 J4.6
LD5
  Top 0.305: U1.P58 28.89,64.14 29.53,64.77 29.53,67.63 J4.5
LD6
  Top 0.305: U1.P57 30.16,64.14 30.8,64.77 J4.4
LD7
  Top 0.305: U1.P56 31.43,64.14 32.07,64.77 32.07,67.63 J4.3
N$1  (via drill 0.6)
  Top 0.406: ZTP1.TP 15.77,55.64 U1.P73
  other vias: 15.8,55.64
N$2  (via drill 0.6)
  Top 0.406: ZTP2.TP 29.53,44.59 ZTP2.TP
  Bottom 0.406: ZTP2.TP 29.13,44.61
  other vias: 29.56,44.59
N$3
  Top 0.406: LED1.- R2.2
N$4  (via drill 0.5, 1.1)
  Top 0.254: R8.1 34.61,20.24 34.29,19.92 v34.29,19.05 | USB1.B5 37.9,17.58 38.1,17.78 v38.58,17.78
  Bottom 0.254: v38.58,17.78 36.67,17.78 35.4,19.05 v34.29,19.05
N$5  (via drill 1.1)
  Top 0.254: USB1.A5 34.56,15.83 34.29,15.56 v34.29,14.61 34.29,13.81 34.61,13.49 R9.1
N$6
  Top 0.406: LED2.- R3.2
N$7
  Top 0.254: R7.1 30.56,16.51 30.27,16.8 U2.8
N$8
  Top 0.254: R6.1 30.56,17.78 30.07,17.3 U2.9
N$11
  Top 0.254: Q2.1
  Top 0.305: Q2.1 R5.2
N$12
  Top 0.305: R4.2 Q1.1
RST  (via drill 0.5)
  Top 0.305: v10.48,63.98 8.73,63.98 8.1,63.34 v8.1,63.02 | Q1.3 20.65,20.79 v20.48,20.96
  Top 0.406: R1.1 37.02,65.02 K1.2 35.75,65.53 34.92,66.36 J4.2 33.34,64.77 v32.7,64.14 U1.P55 | K3.2 4.57,24 5.24,23.34 5.24,17.3 6.35,16.19 J6.3
  Bottom 0.305: v32.7,64.14 32.7,63.66 32.38,63.34 10.64,63.34 10.48,63.5 v10.48,63.98 | v8.1,63.02 9.05,62.07 9.05,54.93 8.57,54.45 8.57,39.05 5.4,35.88 5.4,33.97 4.13,32.7 J5.3 4.13,28.58 4.21,28.5 v4.21,27.54 | v20.48,20.96 20.48,21.75 19.84,22.38 13.18,22.38 11.11,20.32 11.11,17.15 10.16,16.19 J6.3
  Bottom 0.406: v4.21,27.54 v4.21,26.59 v4.21,25.64 4.21,18.34 6.35,16.19 J6.3
RTS  (via drill 0.5)
  Top 0.254: Q1.2 | U2.19 24.55,16.3 23.97,15.72 v23.81,15.72
  Top 0.305: Q1.2 v22.54,19.69 | R5.1 Q1.2
  Bottom 0.305: v23.81,15.72 23.97,15.72 24.61,16.35 24.61,18.26 23.18,19.69 v22.54,19.69
V_USB  (via drill 0.8, 0.9)
  Top 0.305: USB1.A9 36.44,18.33 36.69,18.08 USB1.B4 37.76,18.08 38.26,18.57 39.21,18.57 39.69,18.1 v39.69,14.92 38.34,14.92 37.68,15.58 USB1.B9 36.69,15.58 36.44,15.33 USB1.A4
  Top 0.406: C13.2 32.7,13.97 33.34,13.34 v33.34,12.22
  Top 0.813: C17.2 v33.34,12.22
  Top 1.016: F1.1 v33.34,22.23
  Bottom 0.813: v33.34,22.23 34.61,22.23 34.92,22.54 37.47,22.54 39.69,20.32 v39.69,14.92 39.69,13.34 37.15,10.8 33.81,10.8 33.34,11.27 v33.34,12.22
WIO0
  Top 0.305: U1.WI0 8.27,62.25 7.3,61.28 J1.2

### Text on the board
tPlace: AIoT | DaaN | 5V | DD1 | DD3 | DD5 | DD7 | LD1 | LD3 | LD5 | LD7 | GND | RESET | 5V | DD0 | DD2 | DD4 | DD6 | LD0 | LD2 | LD4 | LD6 | RST | WIO0 | GND | 3V3 | 3V3 | 0 | 1 | 1V8 | 1V8 | 2 | 3 | 5V | 5V | 4 | 5 | 47 | 46 | 6 | 7 | 45 | 44 | 8 | 9 | 43 | 42 | 10 | 11 | 41 | 40 | 12 | 13 | 39 | 38 | 14 | 15 | AIoT | DaaN | 37 | 36 | 16 | 17 | GND | GND | BOOT | 5V | 19 | 21 | 23 | 25 | 27 | 29 | 31 | 33 | 35 | GND | BOOT | RST | RX | TX | GND | 16 | EN | 4 | 5 | 5V | GND | 18 | 20 | 22 | 24 | 26 | 28 | 30 | 32 | 34 | IO13 | POW | RESET | 5V | RX | TX | EN | BOOT | BT | G | 20190505-R2
bPlace: 5V | DD1 | DD3 | DD5 | DD7 | LD1 | LD3 | LD5 | LD7 | GND | 5V | DD0 | DD2 | DD4 | DD6 | LD0 | LD2 | LD4 | LD6 | RST | GND | WIO0 | 3V3 | 3V3 | 0 | 1 | 1V8 | 1V8 | 2 | 3 | 5V | 5V | 4 | 5 | 47 | 46 | 6 | 7 | 45 | 44 | 8 | 9 | 43 | 42 | 10 | 11 | 41 | 40 | 12 | 13 | 39 | 38 | 14 | 15 | DaaN | AIoT | 37 | 36 | 16 | 17 | GND | GND | 5V | 19 | 21 | 23 | 25 | 27 | 29 | 31 | 33 | 35 | GND | BOOT | RESET | RX | TX | 5V | GND | 16 | EN | 4 | 5 | 5V | GND | 18 | 20 | 22 | 24 | 26 | 28 | 30 | 32 | 34 | 5V | RX | TX | EN | BT | G
tNames: CC2 | CC1
tDocu: C1 | J4 | K1 | 100n | C3 | C4 | R1 | 100K | 100n | 10U | C2 | 100n | U1 | Sipeed MAIX-I WIFI | J1 | J3 | K2 | C5 | R2 | R3 | 100n | 2K2 | 2K2 | J2 | C6 | J5 | 100n | LED1 | LED2 | YEL | BLU | K3 | C7 | 100n | C8 | C9 | F1 | 100n | 100n | 5K1 | R8 | C10 | 100n | Q1 | C11 | 47p | U2 | FT231XQ-R | R6 | 27 | K4 | U3 | R4 | R5 | 12K | 12K | R7 | 27 | USB1 | LM1117MPX-3.3NOPB | Q2 | C12 | 47p | C13 | 100n | C15 | R9 | J6 | 100n | C16 | 10U | C17 | 10U | 5K1 | C14 | 100n